# Altium schematic sheet timer_mic.SchDoc
size A3; DocumentNumber: 3; SheetNumber: 3; SheetTotal: 3
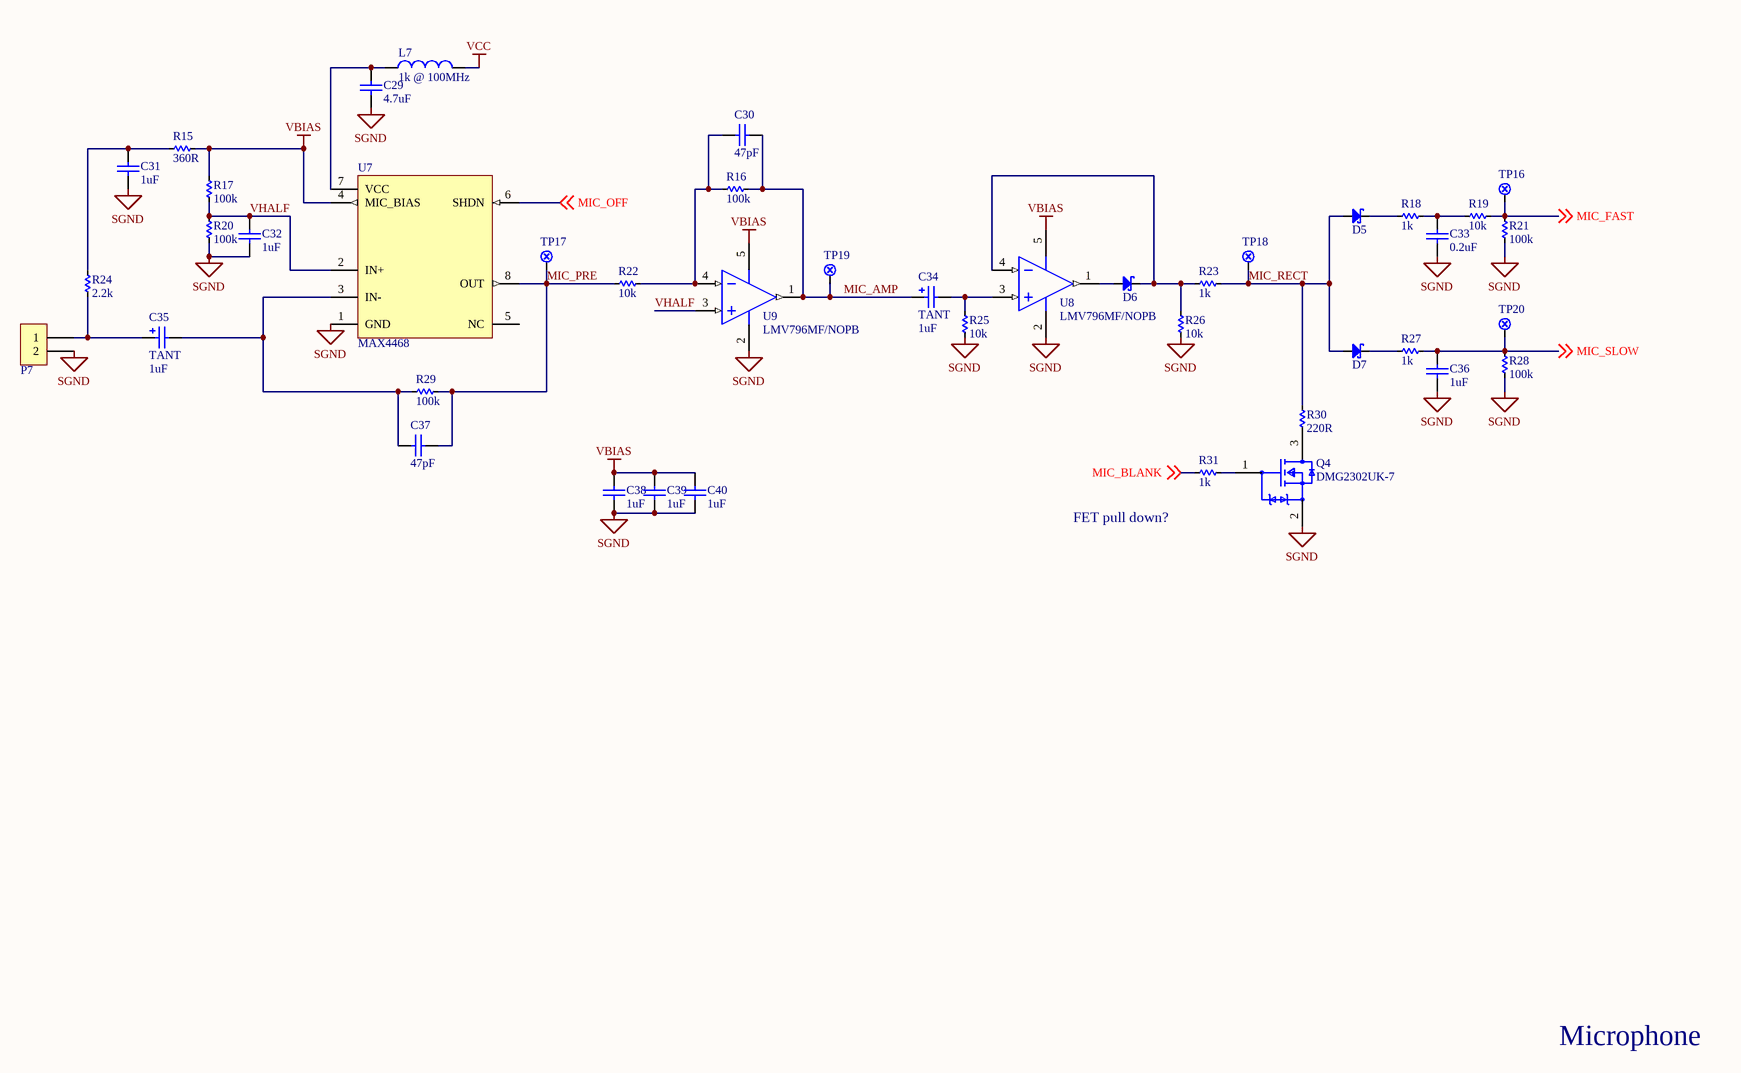
[diagram p0: timer_mic.SchDoc]

## Parts
C29  value 4.7uF  [C0805/2012]  (hidden comment: CAP)
C30  value 47pF  [C0603/1608]  (hidden comment: CAP)
C31  value 1uF  [C0603/1608]  (hidden comment: CAP)
C32  value 1uF  [C0603/1608]  (hidden comment: CAP)
C33  value 0.2uF  [C0603/1608]  (hidden comment: CAP)
C34  value 1uF  Type: TANT  [CP0805/2012]  (hidden comment: POLCAP)
C35  value 1uF  Type: TANT  [CP0805/2012]  (hidden comment: POLCAP)
C36  value 1uF  [C0603/1608]  (hidden comment: CAP)
C37  value 47pF  [C0603/1608]  (hidden comment: CAP)
C38  value 1uF  [C0603/1608]  (hidden comment: CAP)
C39  value 1uF  [C0603/1608]  (hidden comment: CAP)
C40  value 1uF  [C0603/1608]  (hidden comment: CAP)
D5  DIODE_SCHOTTKY  [SOD-123]  (value not drawn)
D6  DIODE_SCHOTTKY  [SOD-123]  (value not drawn)
D7  DIODE_SCHOTTKY  [SOD-123]  (value not drawn)
L7  value 1k @ 100MHz  [R0603/1608]  (hidden comment: FERRITE)
P7  SIL2  [PINS-2]  (value not drawn)
Q4  DMG2302UK-7  [FP-SOT23-MFG]
R15  value 360R  [R0603/1608]  (hidden comment: RES)
R16  value 100k  [R0603/1608]  (hidden comment: RES)
R17  value 100k  [R0603/1608]  (hidden comment: RES)
R18  value 1k  [R0603/1608]  (hidden comment: RES)
R19  value 10k  [R0603/1608]  (hidden comment: RES)
R20  value 100k  [R0603/1608]  (hidden comment: RES)
R21  value 100k  [R0603/1608]  (hidden comment: RES)
R22  value 10k  [R0603/1608]  (hidden comment: RES)
R23  value 1k  [R0603/1608]  (hidden comment: RES)
R24  value 2.2k  [R0603/1608]  (hidden comment: RES)
R25  value 10k  [R0603/1608]  (hidden comment: RES)
R26  value 10k  [R0603/1608]  (hidden comment: RES)
R27  value 1k  [R0603/1608]  (hidden comment: RES)
R28  value 100k  [R0603/1608]  (hidden comment: RES)
R29  value 100k  [R0603/1608]  (hidden comment: RES)
R30  value 220R  [R0603/1608]  (hidden comment: RES)
R31  value 1k  [R0603/1608]  (hidden comment: RES)
TP16  TP  [TP-1.0]  (value not drawn)  (no BOM)
TP17  TP  [TP-1.0]  (value not drawn)  (no BOM)
TP18  TP  [TP-1.0]  (value not drawn)  (no BOM)
TP19  TP  [TP-1.0]  (value not drawn)  (no BOM)
TP20  TP  [TP-1.0]  (value not drawn)  (no BOM)
U7  MAX4468  [SOT23-8]
U8  LMV796MF/NOPB  [DBV0005A_L]
U9  LMV796MF/NOPB  [DBV0005A_L]

## Nets
SGND: C29.1 C31.1 C32.1 C33.1 C36.1 C38.1 C39.1 C40.1 P7.2 Q4.2(S) R20.2 R21.2 R25.2 R26.2 R28.2 U7.1(GND) U8.2(V-) U9.2(V-)
VBIAS: C38.2 C39.2 C40.2 R15.2 R17.1 U7.4(MIC_BIAS) U8.5(V+) U9.5(V+)
VCC: L7.2
MIC_AMP: C30.2 C34.1 R16.1 TP19.0 U9.1(OUT)
MIC_BLANK: R31.2 ; off-sheet MIC_BLANK
MIC_FAST: R19.1 R21.1 TP16.0 ; off-sheet MIC_FAST
MIC_OFF: U7.6(SHDN) ; off-sheet MIC_OFF
MIC_PRE: C37.1 R22.2 R29.2 TP17.0 U7.8(OUT)
MIC_RECT: D5.2 D7.2 R23.1 R30.1 TP18.0
MIC_SLOW: C36.2 R27.1 R28.1 TP20.0 ; off-sheet MIC_SLOW
VHALF: C32.2 R17.2 R20.1 U7.2(IN+) U9.3(IN+)
NetC29_2: C29.2 L7.1 U7.7(VCC)
NetC30_1: C30.1 R16.2 R22.1 U9.4(IN-)
NetC31_2: C31.2 R15.1 R24.1
NetC33_2: C33.2 R18.1 R19.2
NetC34_2: C34.2 R25.1 U8.3(IN+)
NetC35_1: C35.1 P7.1 R24.2
NetC35_2: C35.2 C37.2 R29.1 U7.3(IN-)
NetD5_1: D5.1 R18.2
NetD6_1: D6.1 R23.2 R26.1 U8.4(IN-)
NetD6_2: D6.2 U8.1(OUT)
NetD7_1: D7.1 R27.2
NetQ4_1: Q4.1(G) R31.1
NetQ4_3: Q4.3(D) R30.2

Not connected (* = marked no-connect by the designer): U7 5(NC)

## Notes on the sheet
- (near R31) FET pull down?
- Microphone

## Library data of the parts
C29 C31-C33 C36 C38-C40 = CAP: Capacitor; Tolerance: x%; Voltage: 6.3V; Type: X5R/X7R
C30 C37 = CAP: Capacitor; Tolerance: x%; Voltage: 6.3V; Type: COG/NPO
C34 C35 = CAP_POL: Capacitor; Voltage: 6.3V; Tolerance: x%
D5-D7 = DIODE_SCHOTTKY: Schottky Diode; Voltage: xV; Value: xA
L7 = IND: Inductor
P7 = SIL2: SIL package, 2 pins
Q4 = CMP-12801-000001-1: MOSFET N-CH 20V 2.8A SOT23; Manufacturer: Diodes Inc.; Reverse Recovery Time: 5.3ns; Gate Charge At Vgs: 2.8nC @ 10V; Turn On Delay Time: 0.6ns; Pulse Drain Current: 12A; Max Forward Diode Voltage: 1.2V; Reverse Recovery Charge: 0.5nC; Automotive Grade: Grade 0; Threshold Vgs Min: 0.3V; Number Of N Channels: 1; Standoff Height: 0.013mm; Typ Forward Diode Voltage: 0.7V; Drain To Source Resistance: 61mΩ; Rthja Max: 192°C/W; Max Junction Temp: +150°C; Input Capacitace At Vds: 130pF @ 10V; Threshold Vgs Max: 1V; Turn Off Delay Time: 4.2ns; Depletion Mode: False; Gate To Source Voltage: 12V; Power Dissipation: 0.66W; Device Class L1: Discrete Semiconductors; Footprint Url: https://www.diodes.com/assets/Package-Files/SOT23.pdf; Lead Free: Yes; Manufacturer Part Number: DMG2302UK-7; Temperature Range High: +150°C; Drain To Source Voltage: 20V; Category: Trans; Digikey Description: MOSFET N-CH 20V 2.8A SOT23; RoHS: TRUE; Device Class L2: Transistors; Height: 1.1mm; Automotive: Yes; Package: SOT23; Drain To Source Breakdown Voltage: 20V; Continuous Drain Current: 2.8A; ComponentLink2Description: Datasheet; Device Class L3: MOSFETs; Octopart: https://octopart.com/dmg2302uk-7-diodes+inc.-73850182; Temperature Range Low: -55°C; Temperature: -55°C to +150°C; Number Of Channels: 1; ComponentLink2URL: https://www.diodes.com/assets/Datasheets/DMG2302UK.pdf
R15-R31 = RES: Resistor; Tolerance: x%
TP16-TP20 = TP: Test point
U7 = MAX4468: Low-Cost, Micropower, SOT23-8, Microphone / Preamplifier with Complete Shutdown
U8 U9 = CMP-0055-01076-3: 17 MHz, Low Noise, CMOS Input, 1.8V Operational Amplifiers, 5-pin SOT-23, Pb-Free; Manufacturer: Texas Instruments; PackageTopMarking: AT3A*XTT; PowerWise: Y; PinCount: 5; Package Reference: DBV0005A; PackageDescription: Molded SOT-23, .115 x .063 x .040 in Body, 5 Lead, .0375 in Pitch; RoHS: Y; ComponentLink1Description: Datasheet URL; ComponentLink1URL: http://www.ti.com/general/docs/lit/getliterature.tsp?genericPartNumber=LMV796&fileType=pdf; CompType: Amplifiers